# Altium schematic sheet USB-IRIS-W1_POWER&COMM.SchDoc
size A3; Date: 7/24/2020; CompanyName: U-blox; DrawnBy: ASOH/HEKF; Engineer: ASOH/HEKF; Organization: U-blox; Address1: Östra Varvsgatan 4; Address2: SE-211 75 Malmo; DocumentNumber: 2; Revision: A; SheetNumber: 2; SheetTotal: 4; SheetSize: B; SheetTitle: Interface MCU
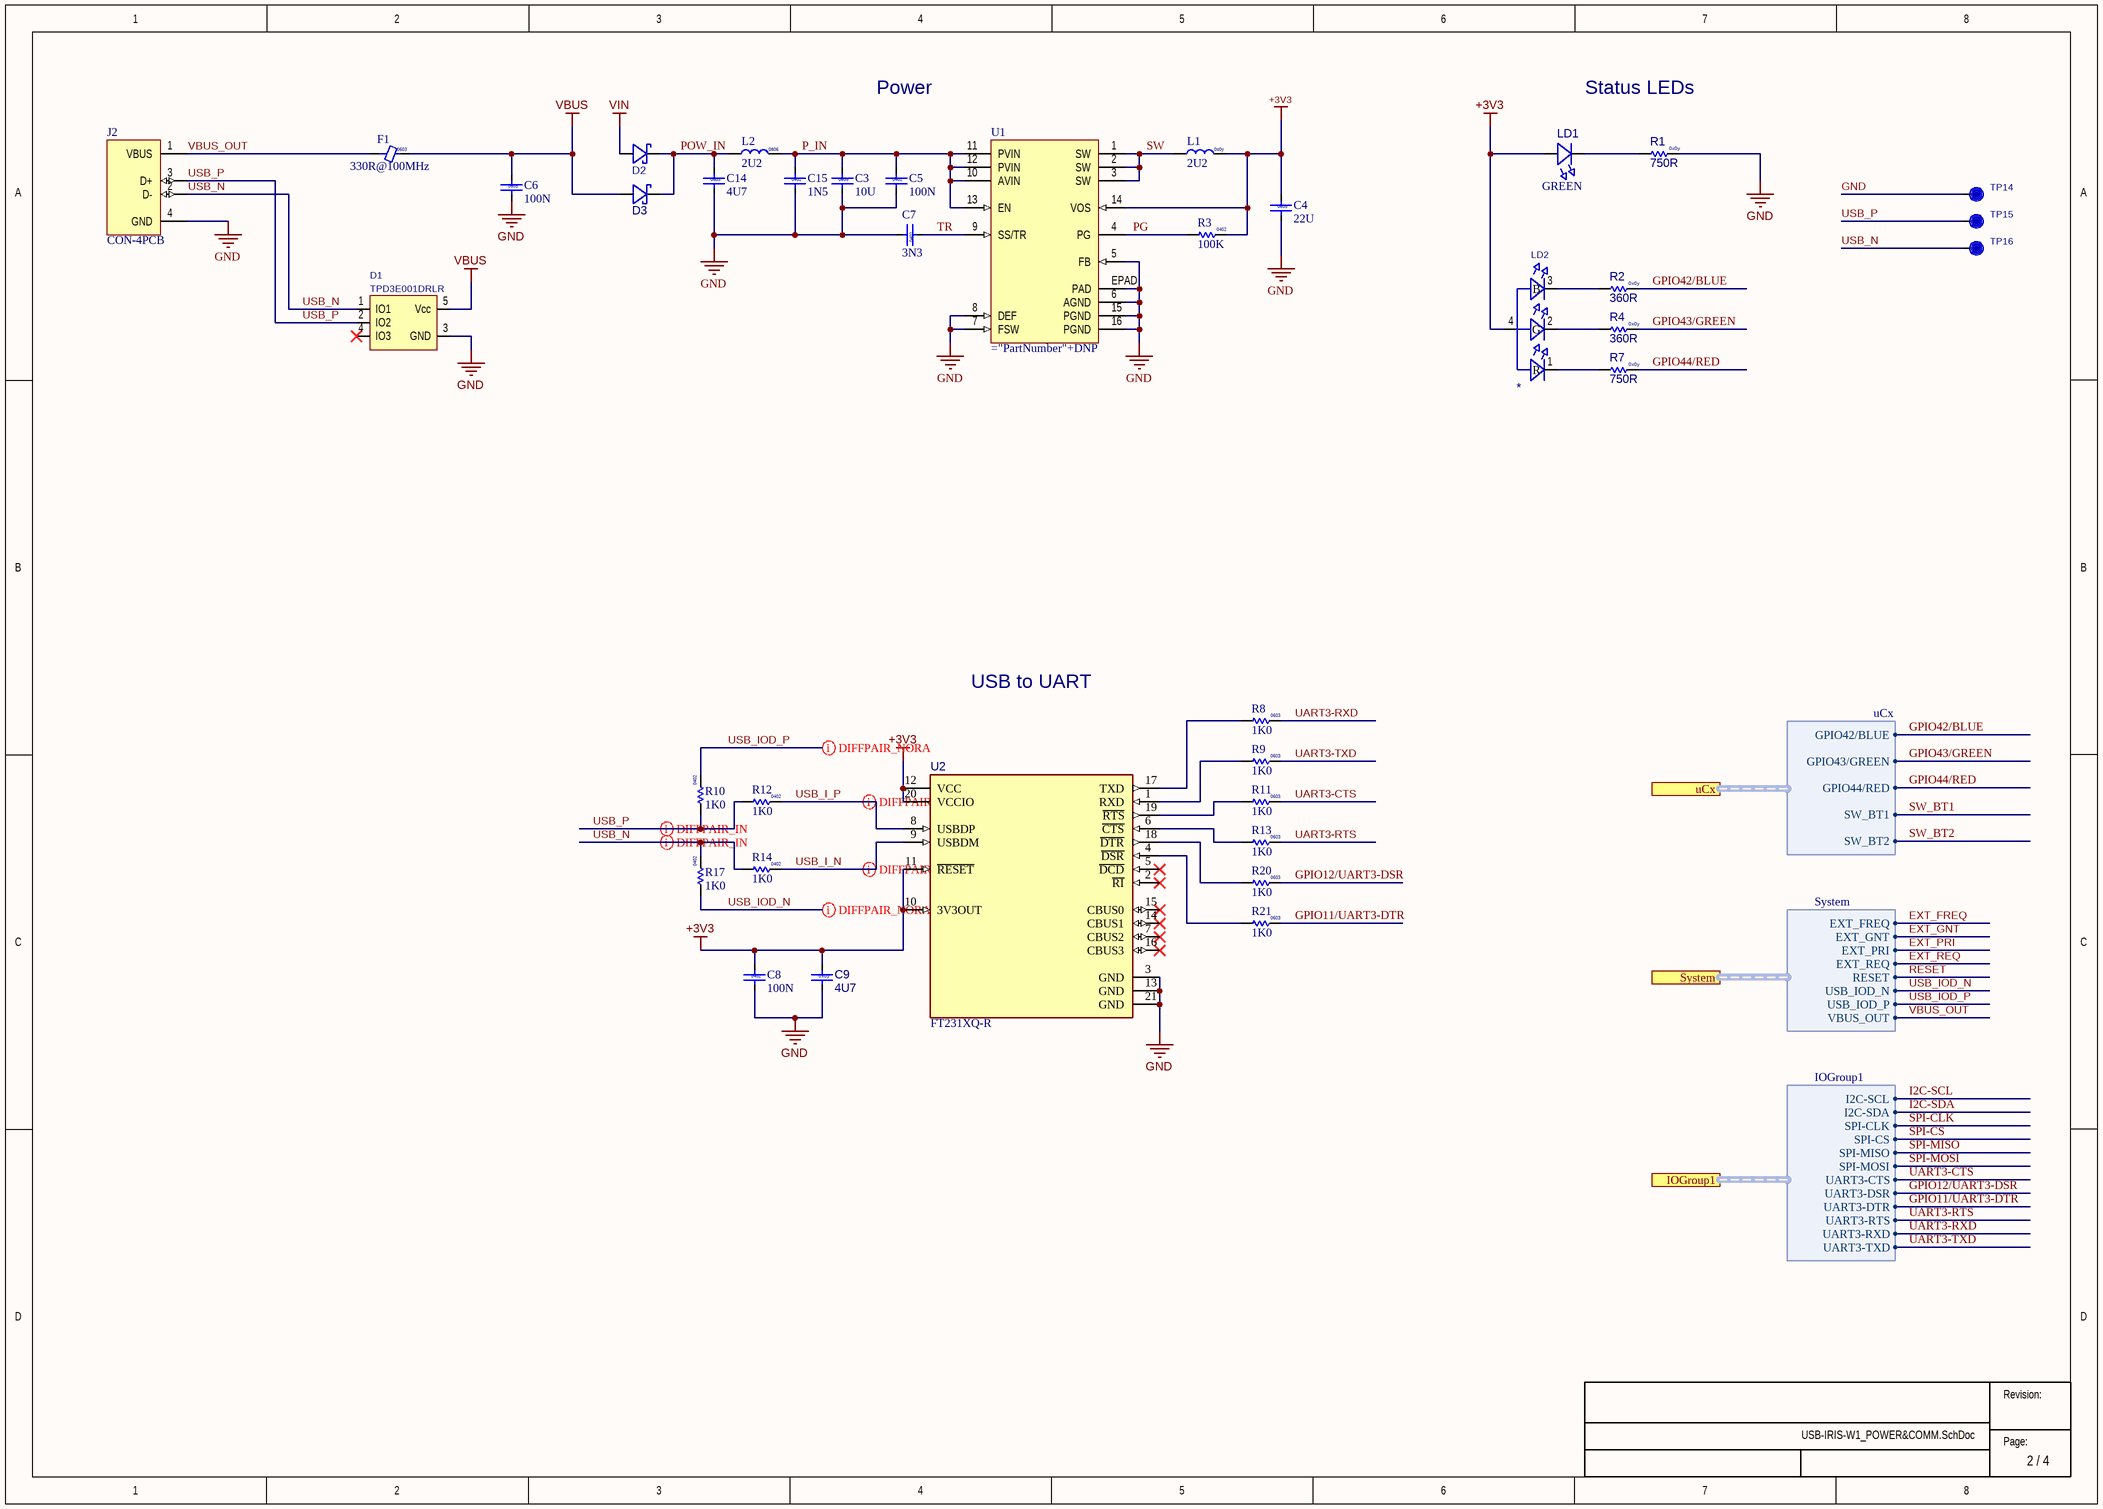
[diagram p0: USB-IRIS-W1_POWER&COMM.SchDoc]

## Parts
C3  value 10U  Size: 0805  [Cap 0805 HD]
C4  value 22U  Size: 0805  [Cap 0805 HD]
C5  value 100N  Size: 0402  [Cap 0402 HD]
C6  value 100N  Size: 0603  [CAP_0603_1750Lx950Wx850H_600x1000Pad_900G_FLX]
C7  value 3N3  Size: 0402  [CAP 0402]
C8  value 100N  Size: 0402  [Cap 0402 HD]
C9  value 4U7  Size: 0x0y  [Cap 0402 HD]
C14  value 4U7  Size: 0603  [CAP_0603_1800Lx1000Wx1000H_600x1000Pad_900G_FLX]
C15  value 1N5  Size: 0402  [CAP 0402]
D1  Manufacturer P/N: TPD3E001DRLR  [SOT-553]  (hidden comment: 110-00018)
D2  (no value)  [SOD-123F_U]
D3  (no value)  [SOD-123F_U]
F1  value 330R@100MHz  Size: 0603  [IND 0603 HD]
J2  CON-4PCB  [USB-A-PCB]
L1  value 2U2  Size: 0x0y  [Ind_4mmx4mm]
L2  value 2U2  Size: 0806  [IND 0806]
LD1  value GREEN  [LED-0603]
LD2  (no value)  [LED_1616]
R1  value 750R  Size: 0x0y  [RES 0402 HD]
R2  value 360R  Size: 0x0y  [RES 0402 HD]
R3  value 100K  Size: 0402  [RES 0402 HD]
R4  value 360R  Size: 0x0y  [RES 0402 HD]
R7  value 750R  Size: 0x0y  [RES 0402 HD]
R8  value 1K0  Size: 0603  [RES 0603 HD]
R9  value 1K0  Size: 0603  [RES 0603 HD]
R10  value 1K0  Size: 0402  [RES 0402 HD]
R11  value 1K0  Size: 0603  [RES 0603 HD]
R12  value 1K0  Size: 0402  [RES 0402 HD]
R13  value 1K0  Size: 0603  [RES 0603 HD]
R14  value 1K0  Size: 0402  [RES 0402 HD]
R17  value 1K0  Size: 0402  [RES 0402 HD]
R20  value 1K0  Size: 0603  [RES 0603 HD]
R21  value 1K0  Size: 0603  [RES 0603 HD]
TP14  TP  [TP10R]  (value not drawn)  (no BOM)
TP15  TP  [TP10R]  (value not drawn)  (no BOM)
TP16  TP  [TP10R]  (value not drawn)  (no BOM)
U1  (no value)  [QFN0.5P3x3-16Pin_W-Pad]
U2  FT231XQ-R  [QFN_5x5_FT231XQ]

## Ports
IOGroup1 (harness IOGroup1), System (harness System), uCx (harness uCx)

## Harnesses
uCx: GPIO42/BLUE, GPIO43/GREEN, GPIO44/RED, SW_BT1, SW_BT2
System: EXT_FREQ, EXT_GNT, EXT_PRI, EXT_REQ, RESET, USB_IOD_N, USB_IOD_P, VBUS_OUT
IOGroup1: I2C-SCL, I2C-SDA, SPI-CLK, SPI-CS, SPI-MISO, SPI-MOSI, UART3-CTS, UART3-DSR, UART3-DTR, UART3-RTS, UART3-RXD, UART3-TXD

## Nets
+3V3: C4.1 C8.1 C9.1 L1.2 LD1.2(A) LD2.4(A) R3.2 U1.14(VOS) U2.10(3V3OUT) U2.11(~{RESET}) U2.12(VCC) U2.20(VCCIO)
GND: C3.2 C4.2 C5.2 C6.2 C7.2 C8.2 C9.2 C14.2 C15.2 D1.3(GND) J2.4(GND) R1.2 TP14.1 U1.5(FB) U1.6(AGND) U1.7(FSW) U1.8(DEF) U1.15(PGND) U1.16(PGND) U1.EPAD(PAD) U2.3(GND) U2.13(GND) U2.21(GND)
VBUS: C6.1 D1.5(Vcc) D3.A(Anode) F1.2
VIN: D2.A(Anode)
EXT_FREQ: port System.EXT_FREQ
EXT_GNT: port System.EXT_GNT
EXT_PRI: port System.EXT_PRI
EXT_REQ: port System.EXT_REQ
GPIO11/UART3-DTR: R21.2 ; port IOGroup1.UART3-DTR
GPIO12/UART3-DSR: R20.2 ; port IOGroup1.UART3-DSR
GPIO42/BLUE: R2.2 ; port uCx.GPIO42/BLUE
GPIO43/GREEN: R4.2 ; port uCx.GPIO43/GREEN
GPIO44/RED: R7.2 ; port uCx.GPIO44/RED
I2C-SCL: port IOGroup1.I2C-SCL
I2C-SDA: port IOGroup1.I2C-SDA
P_IN: C3.1 C5.1 C15.1 L2.2 U1.10(AVIN) U1.11(PVIN) U1.12(PVIN) U1.13(EN)
PG: R3.1 U1.4(PG)
POW_IN: C14.1 D2.C(Cathode) D3.C(Cathode) L2.1
RESET: port System.RESET
SPI-CLK: port IOGroup1.SPI-CLK
SPI-CS: port IOGroup1.SPI-CS
SPI-MISO: port IOGroup1.SPI-MISO
SPI-MOSI: port IOGroup1.SPI-MOSI
SW: L1.1 U1.1(SW) U1.2(SW) U1.3(SW)
SW_BT1: port uCx.SW_BT1
SW_BT2: port uCx.SW_BT2
TR: C7.1 U1.9(SS/TR)
UART3-CTS: R11.2 ; port IOGroup1.UART3-CTS
UART3-RTS: R13.2 ; port IOGroup1.UART3-RTS
UART3-RXD: R8.2 ; port IOGroup1.UART3-RXD
UART3-TXD: R9.2 ; port IOGroup1.UART3-TXD
USB_I_N: R14.2 U2.9(USBDM)
USB_I_P: R12.2 U2.8(USBDP)
USB_IOD_N: R17.1 ; port System.USB_IOD_N
USB_IOD_P: R10.2 ; port System.USB_IOD_P
USB_N: D1.1(IO1) J2.2(D-) R14.1 R17.2 TP16.1
USB_P: D1.2(IO2) J2.3(D+) R10.1 R12.1 TP15.1
VBUS_OUT: F1.1 J2.1(VBUS) ; port System.VBUS_OUT
NetLD1_1: LD1.1(C) R1.1
NetLD2_1: LD2.1(R) R7.1
NetLD2_2: LD2.2(G) R4.1
NetLD2_3: LD2.3(B) R2.1
NetR8_1: R8.1 U2.17(TXD)
NetR9_1: R9.1 U2.1(RXD)
NetR11_1: R11.1 U2.19(~{RTS})
NetR13_1: R13.1 U2.6(~{CTS})
NetR20_1: R20.1 U2.18(~{DTR})
NetR21_1: R21.1 U2.4(~{DSR})

Not connected (* = marked no-connect by the designer): D1 4(IO3)*; U2 2(~{RI})* 5(~{DCD})* 7(CBUS2)* 14(CBUS1)* 15(CBUS0)* 16(CBUS3)*

## Layout directives
differential pair; net class DIFF100: USB_I_N, USB_I_P, USB_IOD_N, USB_IOD_P, USB_N, USB_P

## Notes on the sheet
- Power
- Status LEDs
- USB to UART
- Revision:
- Page:

## Library data of the parts
C3 = UBXH01-0000261: CAP CER X5R 0805 10U 10% 25V; Manufacturer: Murata Manufacturing Company, Ltd.; Manufacturer P/N: GRM21BR61E106KA73; Editor: erian.bezhani; Released by: alex.claville; Env: ROHS; Permitted Use: Volume Products; Perferred: PREF; Mfg P/N Status: Active; Mfg P/N Split: 100; Mfg P/N Released: Yes; Part Number: UBXH01-0000261; Tolerance: 10%; Max Voltage: 25V; Part Type: Capacitor; Release Data: 2019-05-03T17:04:27; UBX Wiki: https://wiki.u-blox.com/bin/view/Operations/PartDetails?index=24683; RefDes: C
C4 = UBXH01-0000414: CAP CER X5R 0805 22U 20% 25V; Manufacturer: Murata Manufacturing Company, Ltd.; Manufacturer P/N: GRM21BR61E226ME44L; Editor: jaakko.jussila; Env: ROHS; Permitted Use: Support Products; Perferred: PREF; Mfg P/N Status: Active; Mfg P/N Split: 100; Mfg P/N Released: No; Part Number: UBXH01-0000414; Tolerance: 20%; Max Voltage: 25V; Min Operating Temp: -55°C; Max Operating Temp: 85°C; Part Type: Capacitor; UBX Wiki: https://wiki.u-blox.com/bin/view/Operations/PartDetails?index=30004; RefDes: C; Mfg P/N Datasheet: https://wiki.u-blox.com/bin/view/Generic/Docs/DocumentSummary?index=29981
C5 C8 = UBXH01-2021002: CAP CER X5R 0402 100N 10% 10V; Manufacturer: Murata Manufacturing Company, Ltd.; Manufacturer P/N: GRM155R61A104KA01; Editor: roland.rust; Env: GREEN; Permitted Use: Volume Products; Perferred: PREF; Mfg P/N Status: NRND; Mfg P/N Split: 100; Mfg P/N Released: Yes; Part Number: UBXH01-2021002; Tolerance: 10%; Max Voltage: 10V; Part Type: Capacitor; Released by: roland.rust; Release Data: 2005-07-22T13:59:44; UBX Wiki: https://wiki.u-blox.com/bin/view/Operations/PartDetails?index=5759; RefDes: C; Manufacturer 2: Samsung Electro-Mechanics; Manufacturer P/N 2: CL05A104KP5NNN; Mfg P/N Status 2: Active; Mfg P/N Split 2: 0; Mfg P/N Released 2: Yes; Mfg P/N Datasheet 2: https://wiki.u-blox.com/bin/view/Generic/Docs/DocumentSummary?index=28113
C6 = UBXH01-2022001: CAP CER X7R 0603 100N 10% 50V; Manufacturer: Murata Manufacturing Company, Ltd.; Manufacturer P/N: GRM188R71H104KA93; Editor: andreas.thiel; Released by: johann.furrer; Env: ROHS; Permitted Use: Volume Products; Perferred: NONPREF; Mfg P/N Status: Obsolete; Mfg P/N Split: 100; Mfg P/N Released: Yes; Part Number: UBXH01-2022001; Tolerance: 10%; Max Voltage: 50V; Part Type: Capacitor; Release Data: 2010-04-01T16:00:29; UBX Wiki: https://wiki.u-blox.com/bin/view/Operations/PartDetails?index=5767; RefDes: C; Mfg P/N Datasheet: https://wiki.u-blox.com/bin/view/Generic/Docs/DocumentSummary?index=8644; Manufacturer 2: Samsung Electro-Mechanics; Manufacturer P/N 2: CL10B104KB8NFNC; Mfg P/N Status 2: Active; Mfg P/N Split 2: 0; Mfg P/N Released 2: Yes; Mfg P/N Datasheet 2: https://wiki.u-blox.com/bin/view/Generic/Docs/DocumentSummary?index=29478; Manufacturer 3: TDK Corporation; Manufacturer P/N 3: CGA3E2X7R1H104K080AA; Mfg P/N Status 3: Active; Mfg P/N Split 3: 0; Mfg P/N Released 3: Yes; Mfg P/N Datasheet 3: https://wiki.u-blox.com/bin/view/Generic/Docs/DocumentSummary?index=29486
C7 = UBXH01-0023019: CAP CER X7R 0402 3N3 10% 16V; Manufacturer: Murata Manufacturing Company, Ltd.; Manufacturer P/N: GRM155R71H332KA01; Editor: dario.antonaz; Released by: pierpaolo.arban; Env: ROHS; Permitted Use: Volume Products; Perferred: PREF; Mfg P/N Status: NRND; Mfg P/N Split: 100; Mfg P/N Released: Yes; Part Number: UBXH01-0023019; Tolerance: 10%; Max Voltage: 16V; Part Type: Capacitor; Release Data: 2013-08-21T12:21:41; UBX Wiki: https://wiki.u-blox.com/bin/view/Operations/PartDetails?index=5479; RefDes: C; Mfg P/N Datasheet: https://wiki.u-blox.com/bin/view/Generic/Docs/DocumentSummary?index=19430
C9 = UBXH01-0000243: CAP CER X5R 0402; Manufacturer: Murata Manufacturing Company, Ltd.; Manufacturer P/N: GRM155R61A475MEAA; Tolerance: 20%; Max Voltage: 10.0V; Editor: dario.antonaz; Released by: pasquale.scorca; Env: ROHS; Permitted Use: Volume Products; Perferred: PREF; Mfg P/N Status: Active; Mfg P/N Split: 100; Mfg P/N Released: Yes; Part Number: UBXH01-0000243; Min Operating Temp: -40°C; Max Operating Temp: 85°C; Part Type: Capacitor; Release Data: 2016-03-17 10:02:21.014314; UBX Wiki: https://wiki.u-blox.com/bin/view/Operations/PartDetails?index=24303; RefDes: C; Mfg P/N Datasheet: https://wiki.u-blox.com/bin/view/Generic/Docs/DocumentSummary?index=24302
C14 = UBXH01-0000247: CAP CER X5R 0603 4U7 20% 10V; Manufacturer: Murata Manufacturing Company, Ltd.; Manufacturer P/N: GRM185R61A475ME11; Editor: dario.antonaz; Released by: martin.grasse; Env: ROHS; Permitted Use: Volume Products; Perferred: PREF; Mfg P/N Status: NRND; Mfg P/N Split: 100; Mfg P/N Released: Yes; Part Number: UBXH01-0000247; Tolerance: 20%; Max Voltage: 10V; Min Operating Temp: -40°C; Max Operating Temp: 85°C; Part Type: Capacitor; Release Data: 2018-01-09T13:14:17; UBX Wiki: https://wiki.u-blox.com/bin/view/Operations/PartDetails?index=24365; RefDes: C; Mfg P/N Datasheet: https://wiki.u-blox.com/bin/view/Generic/Docs/DocumentSummary?index=24364
C15 = UBXH01-0000211: CAP CER X7R 0402 1N5 10% 50V; Manufacturer: Murata Manufacturing Company, Ltd.; Manufacturer P/N: GRM155R71H152KA01; Editor: domenico.volpe; Released by: massimo.vlacci; Env: ROHS; Permitted Use: Volume Products; Perferred: PREF; Mfg P/N Status: NRND; Mfg P/N Split: 100; Mfg P/N Released: Yes; Part Number: UBXH01-0000211; Tolerance: 10%; Max Voltage: 50V; Min Operating Temp: -55°C; Max Operating Temp: 125°C; Part Type: Capacitor; Release Data: 2015-11-04T16:43:52; UBX Wiki: https://wiki.u-blox.com/bin/view/Operations/PartDetails?index=23369; RefDes: C; Mfg P/N Datasheet: https://wiki.u-blox.com/bin/view/Generic/Docs/DocumentSummary?index=23371; Manufacturer 2: Samsung Electro-Mechanics; Manufacturer P/N 2: CL05B152KB5NNN; Mfg P/N Status 2: Active; Mfg P/N Split 2: 0; Mfg P/N Released 2: Yes; Mfg P/N Datasheet 2: https://wiki.u-blox.com/bin/view/Generic/Docs/DocumentSummary?index=23370
D1 = 110-00018: LOW-CAPACITANCE 3-CHANNEL ESD-PROTECTION ARRAY; Part Name: TVS Diode, 3CH High Speed ESD; Part_Type: Diode; Manufacturer: Texas Instruments; Item_Phase: Production; Body Size: 1.6mm x 1.2mm; Component Mounting Type: SMT; Diode Type: TVS; Use in new designs: Yes; Voltage: 5V; Part Number: 110-00018; Revision: 0A; Supplier 1: Digi-Key; Supplier Part Number 1: 296-21885-1-ND; Arena Link: https://app.bom.com/a/UCV39GZGZIHX50AE?v=spec.summary; Height: .55mm; MFG Package: SOT-553; Package Type: SOT; Pins: 5
D2 D3 = 110-00005: Diode, Schottky, 20V 1A SOD-123F, 340mV Vf @ 1A / MBR120VLSFT3G; Manufacturer 1: ON Semiconductor; Part Name: Diode Schottky 20V 1A SOD-123FL; Body Size: None; Item Phase: In Production; MFG Package: SOD-123FL; Use in new designs: Yes; Part Number: 110-00005; Manufacturer Part Number 1: MBR120VLSFT3G; Supplier 1: Digi-Key; Supplier Part Number 1: MBR120VLSFT3GOSCT-ND; Manufacturer 2: None; Manufacturer Part Number 2: None; Supplier 2: None; Supplier Part Number 2: None; Current: 1A; Height: 0.98mm; Max Operating Temp: 125; Min Operating Temp: -65; Pins: 2; Revision: 0B; Voltage: 20V; UBX Code: None
F1 = FB sm: FERRITE BEAD MURATA BLM18KG 0603 330R@100MHz; Manufacturer: Murata Electronics; Manufacturer P/N: BLM18KG331BH1D; Env: ROHS; Permitted Use: Volume Products; Perferred: PREF; Mfg P/N Status: Active; Mfg P/N Split: 100; Mfg P/N Released: Yes; Part Type: Ferrite; RefDes: FB
J2 = UBXH04-0000711: CONN USB PLUG A TYPE PCB FOOTPRINT; Editor: aneeb.sohail; Env: ROHS; Permitted Use: Support Products; Part Number: UBXH04-0000711; Part Type: Connector; UBX Wiki: https://wiki.u-blox.com/bin/view/Operations/PartDetails?index=35472; Perferred: N/A; RefDes: J
L1 = UBXH09-0000176: SHIELDED POWER INDUCTOR XFL4020 2U2 20% 3.1A; Manufacturer: Coilcraft; Manufacturer P/N: XFL4020-222ME; Editor: roland.rust; Released by: olof.viklund; Env: ROHS; Permitted Use: Support Products; Perferred: PREF; Mfg P/N Status: Active; Mfg P/N Split: 100; Mfg P/N Released: Yes; Part Number: UBXH09-0000176; Tolerance: 20%; Max Current: 3.1A; Min Operating Temp: -40°C; Max Operating Temp: 125°C; Part Type: Inductor; Release Data: 2015-06-17T10:51:21; UBX Wiki: https://wiki.u-blox.com/bin/view/Operations/PartDetails?index=22578; RefDes: L; Mfg P/N Datasheet: https://wiki.u-blox.com/bin/view/Generic/Docs/DocumentSummary?index=22577
L2 = UBXH09-0000025: IND MURATA LQM2MP 0806 2U2 30% 1.2A; Manufacturer: Murata Manufacturing Company, Ltd.; Manufacturer P/N: LQM2MPN2R2NG0; Editor: martin.pilik; Released by: fabrice.bret-dibat; Env: GREEN; Permitted Use: Volume Products; Perferred: PREF; Mfg P/N Status: Active; Mfg P/N Split: 100; Mfg P/N Released: Yes; Part Number: UBXH09-0000025; Tolerance: 30%; Max Current: 1.2A; Min Operating Temp: -55°C; Max Operating Temp: 125°C; Part Type: Inductor; Release Data: 2021-05-07T14:56:17; UBX Wiki: https://wiki.u-blox.com/bin/view/Operations/PartDetails?index=9109; RefDes: L; Mfg P/N Datasheet: https://wiki.u-blox.com/bin/view/Generic/Docs/DocumentSummary?index=9215
LD1 = UBXH11-0000018: LED CHIP 0603 LOW CURRENT OSRAM 0.002A; Manufacturer P/N: LG L29K-G2J1-24; Max Voltage: 2.2V; Max Current: 2mA; Editor: johann.furrer; Released by: martin.grasse; Env: ROHS; Permitted Use: Volume Products; Perferred: PREF; Mfg P/N Status: Active; Mfg P/N Split: 100; Mfg P/N Released: Yes; Color: *; Part Number: UBXH11-0000018; Min Operating Temp: -40°C; Max Operating Temp: 85°C; Part Type: LED; Release Data: 2018-01-09 15:31:38.754561; UBX Wiki: https://wiki.u-blox.com/bin/view/Operations/PartDetails?index=20619; RefDes: DS; Manufacturer: Osram; Mfg P/N Datasheet: https://wiki.u-blox.com/bin/view/Generic/Docs/DocumentSummary?index=20620
LD2 = 115-00026: LED RGB SMT 0606; Manufacturer 1: Lite-On Inc; Manufacturer Part Number 1: LTST-C19HE1WT; Body Size: 1.6mm x 1.6mm; Current: 20mA; Item Phase: In Production; MFG Package: 0606; Use in new designs: Yes; Voltage: None; Color: *; Part Number: 115-00026; Supplier 1: Digi-Key; Supplier Part Number 1: 160-2162-1-ND; Height: 0.35mm; Max Operating Temp: 80; Min Operating Temp: -20; Part Name: LED RGB SMT 0606; Pins: 4; Revision: 0B; Size: Other; UBX Code: None; Supplier 2: Digi-Key; Supplier Part Number 2: 1516-1184-1-ND
R1 R7 = UBXH18-0008046: RES THICK FILM CHIP 0402; Manufacturer: Panasonic; Manufacturer P/N: ERJ2GEJ751X; Tolerance: 5%; Max Power: 100mW; Editor: jaka.bevk; Released by: erian.bezhani; Env: ROHS; Permitted Use: Volume Products; Perferred: PREF; Mfg P/N Status: Active; Mfg P/N Split: 100; Mfg P/N Released: Yes; Part Number: UBXH18-0008046; Part Type: Resistor; Release Data: 2014-10-03 09:31:33.687559; UBX Wiki: https://wiki.u-blox.com/bin/view/Operations/PartDetails?index=6935; RefDes: R; Mfg P/N Datasheet: https://wiki.u-blox.com/bin/view/Generic/Docs/DocumentSummary?index=21267
R2 R4 = UBXH18-0000216: RES THICK FILM CHIP 0402; Manufacturer: KOA; Manufacturer P/N: RK73H1ETTP3600F; Tolerance: 1%; Max Power: 63mW; Editor: michael.hein; Released by: vasyl.dykyy; Env: ROHS; Permitted Use: Volume Products; Perferred: PREF; Mfg P/N Status: Active; Mfg P/N Split: 100; Mfg P/N Released: Yes; Part Number: UBXH18-0000216; Part Type: Resistor; Release Data: 2015-10-02 11:55:45.476057; Automotive: Yes; UBX Wiki: https://wiki.u-blox.com/bin/view/Operations/PartDetails?index=23306; RefDes: R; Mfg P/N Datasheet: https://wiki.u-blox.com/bin/view/Generic/Docs/DocumentSummary?index=8222
R3 = UBXH18-0000005: RES THICK FILM CHIP 0402 100K 1% 63mW; Manufacturer: KOA; Manufacturer P/N: RK73H1ETTP1003F; Editor: dario.antonaz; Released by: sandro.sestan; Env: ROHS; Permitted Use: Volume Products; Mfg P/N Status: Active; Mfg P/N Split: 100; Mfg P/N Released: Yes; Part Number: UBXH18-0000005; Tolerance: 1%; Max Power: 63mW; Part Type: Resistor; Release Data: 2009-11-30T11:05:22; UBX Wiki: https://wiki.u-blox.com/bin/view/Operations/PartDetails?index=8114; Perferred: N/A; RefDes: R; Mfg P/N Datasheet: https://wiki.u-blox.com/bin/view/Generic/Docs/DocumentSummary?index=8222; Manufacturer 2: ROHM; Manufacturer P/N 2: MCR01MZPF1003; Mfg P/N Status 2: Active; Mfg P/N Split 2: 0; Mfg P/N Released 2: Yes; Mfg P/N Datasheet 2: https://wiki.u-blox.com/bin/view/Generic/Docs/DocumentSummary?index=8186
R8 R9 R11 R13 R20 R21 = UBXH18-0007073: RES THICK FILM CHIP 0603 1K0 5% 100mW; Manufacturer: YAGEO; Manufacturer P/N: RC0603JR-071KL; Editor: roland.rust; Env: ROHS; Permitted Use: Volume Products; Perferred: PREF; Mfg P/N Status: Active; Mfg P/N Split: 100; Mfg P/N Released: Yes; Part Number: UBXH18-0007073; Tolerance: 5%; Max Power: 100mW; Part Type: Resistor; Released by: roland.rust; Release Data: 2008-06-24T15:59:29; UBX Wiki: https://wiki.u-blox.com/bin/view/Operations/PartDetails?index=6701; RefDes: R; Manufacturer 2: ROHM; Manufacturer P/N 2: MCR03EZPJ102; Mfg P/N Status 2: Active; Mfg P/N Split 2: 0; Mfg P/N Released 2: Yes
R10 R12 R14 R17 = UBXH18-0008049: RES THICK FILM CHIP 0402 1K0 5% 100mW; Manufacturer: YAGEO; Manufacturer P/N: 2322_705_70102_L; Editor: roland.rust; Env: ROHS; Permitted Use: Volume Products; Perferred: PREF; Mfg P/N Status: Obsolete; Mfg P/N Split: 100; Mfg P/N Released: Yes; Part Number: UBXH18-0008049; Tolerance: 5%; Max Power: 100mW; Part Type: Resistor; Released by: roland.rust; Release Data: 2005-07-22T13:59:44; UBX Wiki: https://wiki.u-blox.com/bin/view/Operations/PartDetails?index=6939; RefDes: R; Manufacturer 2: KOA; Manufacturer P/N 2: RK73B1ETTD102J; Mfg P/N Status 2: NRND; Mfg P/N Split 2: 0; Mfg P/N Released 2: Yes
TP14-TP16 = TP10R: Testpoint, Round 1.0mm Dia; Added By: Jeremy D; Part Number: TP10R; Size: 1.0mm; Height: 0; DNP: DNP; Added Date: 2/1/2015; Checked By: Paul B; Checked Date: 2/5/2015
U1 = UBXH12-0000160: STEP DOWN DC-DC CONVERTER 3-17V 3A TPS62132 3V3; Manufacturer: Texas Instruments; PartNumber: TPS62132RGTR; Manufacturer P/N: TPS62132RGTT; Switch Current Limit(Typ)(A): 4.2; Vout(Max)(V): 3.3; Iout(Max)(A): 3; Regulated Outputs(#): 1; Rating: Catalog; Vin(Max)(V): 17; Synchronous Rectification: TRUE; SubFamily: Step-Down Regulator; Eco-Plan: Green (RoHS & no Sb/Br); Duty Cycle(Max)(%): 100; Iq(Typ)(mA): 0.017; Topology: Buck; Editor: andre.pick; Released by: alvaro.nussbaum; Env: GREEN; Permitted Use: Support Products; Perferred: PREF; Mfg P/N Status: Active; Mfg P/N Released: Yes; DatasheetVersion: SLVSAG7; ComponentLink3Description: URL Link1; ComponentLink1Description: Datasheet; Vin(Min)(V): 3; PackageDescription: 16-Pin Plastic Quad Flat No-Lead, 3 x 3 mm Body, 0.5 mm Pitch, 1.7 x 1.7 mm Exposed Pad; Mounting Technology: Surface Mount; Preset Vout(V): 3.3; Code_JEDEC: MO-220; ComponentLink1URL: http://www.ti.com/general/docs/lit/getliterature.tsp?genericPartNumber=TPS62132&fileType=pdf; Vout(Min)(V): 3.3; ComponentLink2URL: http://www.ti.com/litv/pdf/mpqf119g; ComponentLink2Description: Package Specification; PackageReference: RGT0016C; PackageVersion: revH, Oct-2011; ComponentLink3URL: Samples URL:http://www.ti.com/product/tps62132#samples; Part Number: UBXH12-0000160; Value: 3V3; Min Operating Temp: -40°C; Max Operating Temp: 85°C; Part Type: Regulator; Release Data: 2021-03-11T12:33:47; UBX Wiki: https://wiki.u-blox.com/bin/view/Operations/PartDetails?index=22570; RefDes: U; Mfg P/N Split: 100; Mfg P/N Datasheet: https://wiki.u-blox.com/bin/view/Generic/Docs/DocumentSummary?index=19244; Manufacturer Part Number: TPS62132RGTR
U2 = UBXH10-0000054: FTDI USB TO SERIAL FULL UART INTERFACE QFN20; Manufacturer: FTDI Future Technology Devices International; Editor: adam.johansson; Env: ROHS; Permitted Use: Support Products; Perferred: PREF; Mfg P/N Status: Active; Mfg P/N Split: 100; Mfg P/N Released: No; Part Number: UBXH10-0000054; Value: FT231XQ-R; Min Operating Temp: -40°C; Max Operating Temp: 85°C; Part Type: Interface; UBX Wiki: https://wiki.u-blox.com/bin/view/Operations/PartDetails?index=27258; RefDes: U; Manufacturer P/N: FT231XQ-R; Mfg P/N Datasheet: https://wiki.u-blox.com/bin/view/Generic/Docs/DocumentSummary?index=33707